# EAGLE design PCB-2x8GPIO-U (EAGLE 6.4)

## Sheet 1 of 2
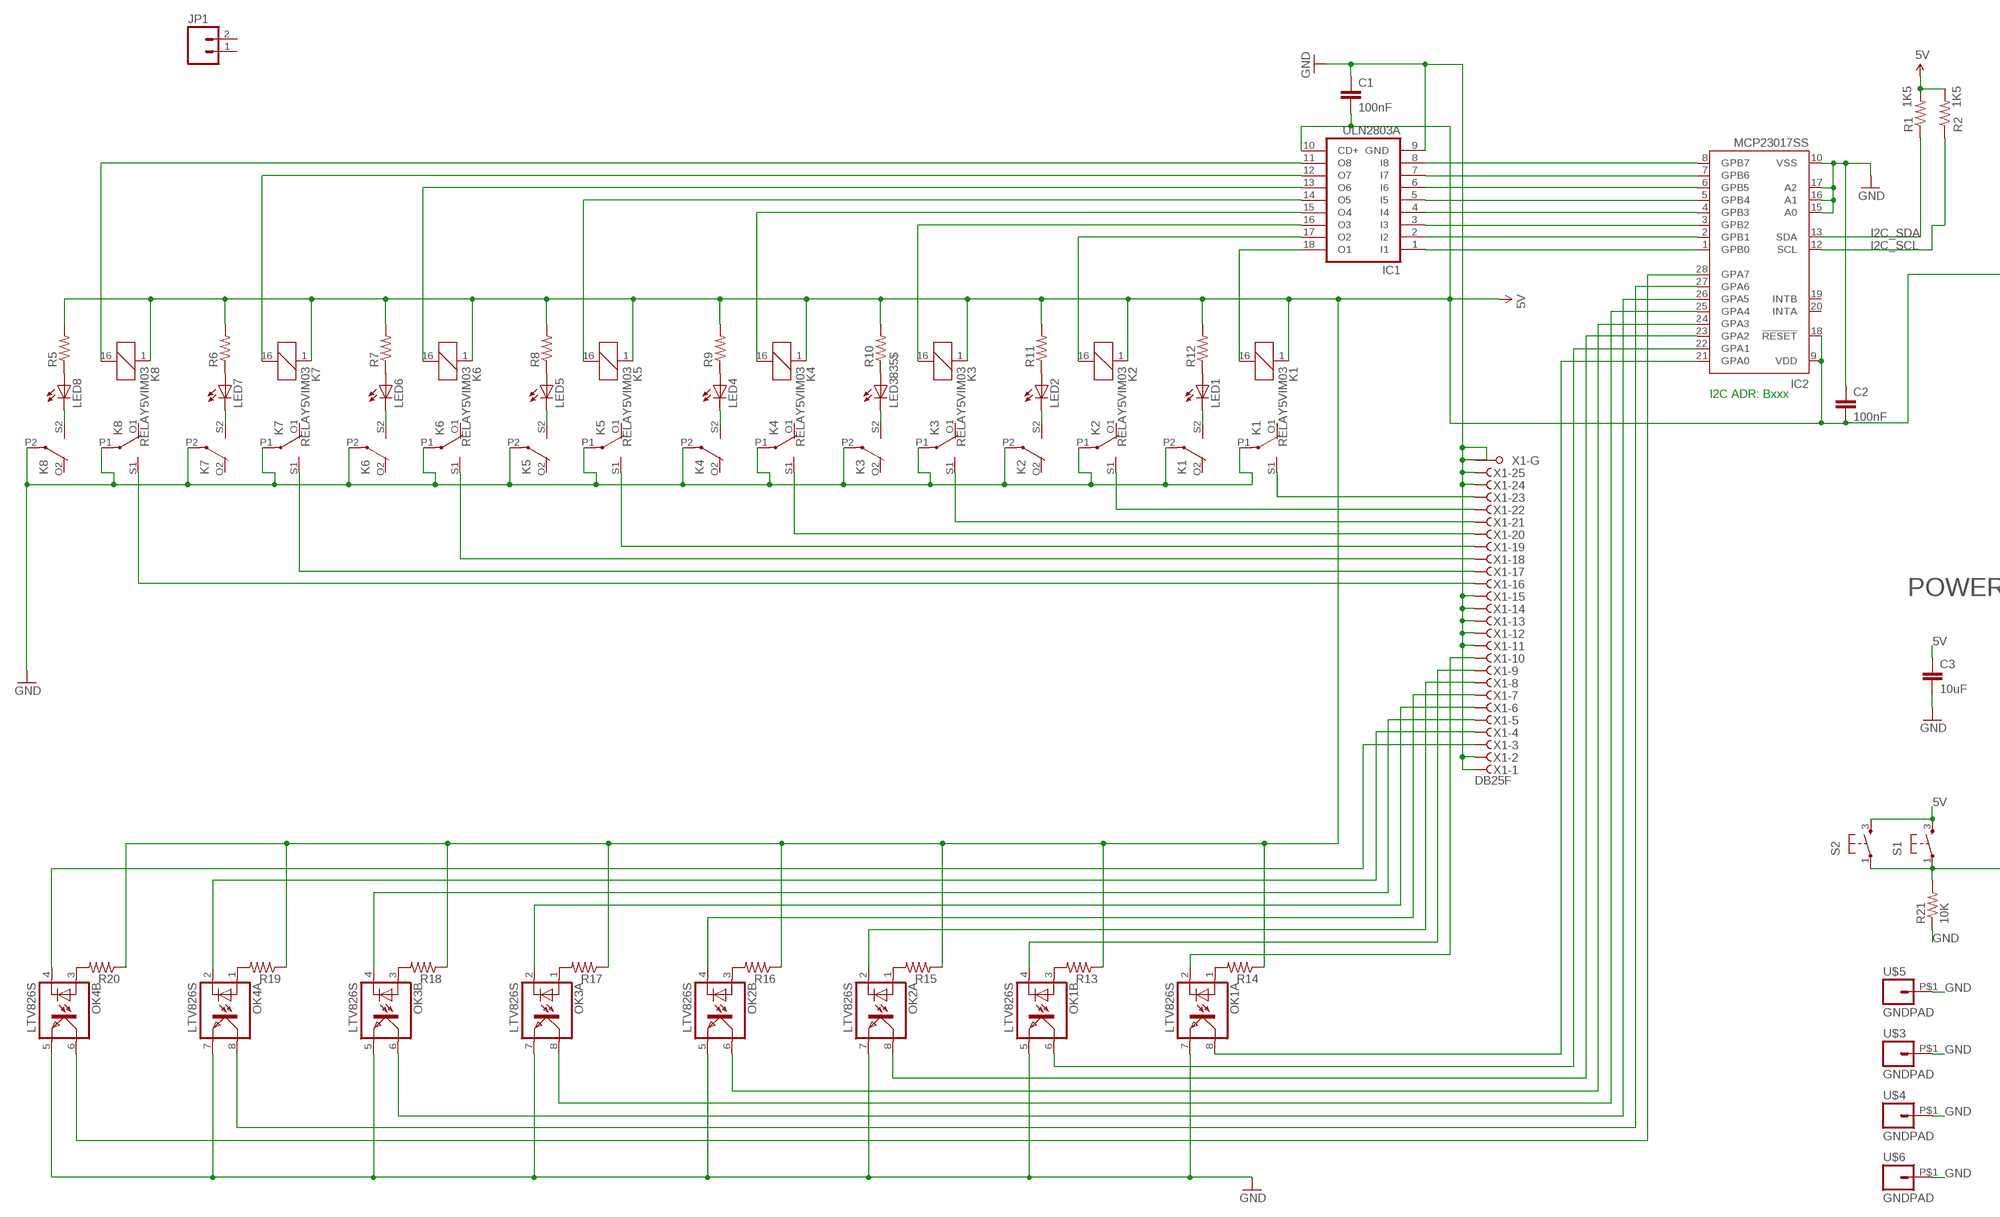
[diagram p0: schematic, sheet 1, part 1 of 2]
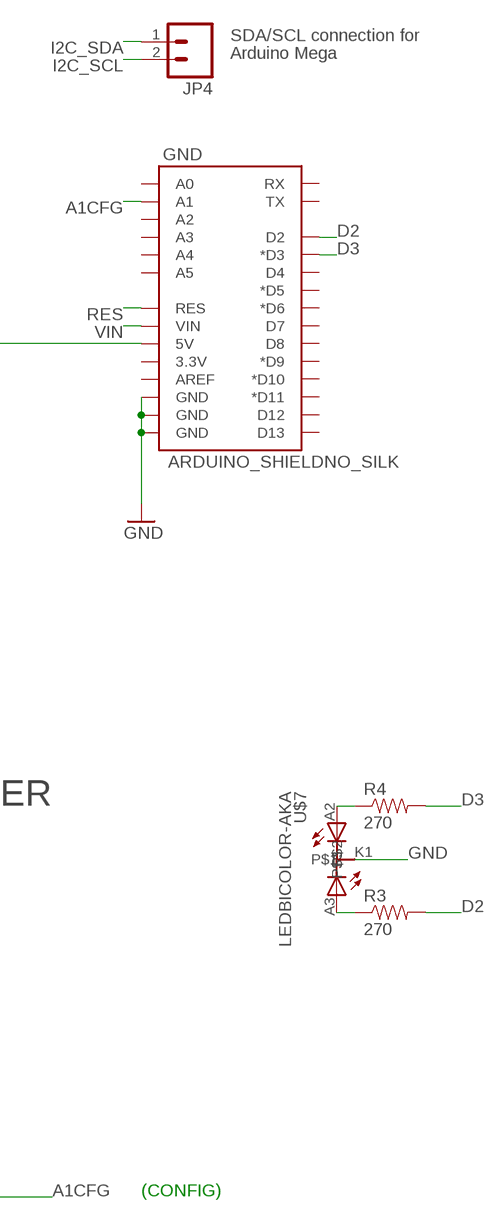
[diagram p1: schematic, sheet 1, part 2 of 2]

### Parts
C1  100nF  CAP0805  [0805]
C2  100nF  CAP0603-CAP  [0603-CAP]
C3  10uF  CAP0805  [0805]
GND  ARDUINO_SHIELDNO_SILK  [DUEMILANOVE_VIAS]
IC1  ULN2803A  ULN2803ASO18W  [SO18W]
IC2  MCP23017SS  [SSOP28]
JP1  M02PTH  [1X02]
JP4  M02PTH  [1X02]
K1  RELAY5VIM03  [DS2Y]
K2  RELAY5VIM03  [DS2Y]
K3  RELAY5VIM03  [DS2Y]
K4  RELAY5VIM03  [DS2Y]
K5  RELAY5VIM03  [DS2Y]
K6  RELAY5VIM03  [DS2Y]
K7  RELAY5VIM03  [DS2Y]
K8  RELAY5VIM03  [DS2Y]
LED1  LED1206  [LED-1206]
LED2  LED1206  [LED-1206]
LED4  LED1206  [LED-1206]
LED5  LED1206  [LED-1206]
LED6  LED1206  [LED-1206]
LED7  LED1206  [LED-1206]
LED8  LED1206  [LED-1206]
LED3835$  LED1206  [LED-1206]
OK1  LTV826S  [DIL8-SMD]
OK2  LTV826S  [DIL8-SMD]
OK3  LTV826S  [DIL8-SMD]
OK4  LTV826S  [DIL8-SMD]
R1  1K5  RESISTOR0603-RES  [0603-RES]
R2  1K5  RESISTOR0603-RES  [0603-RES]
R3  270  RESISTOR0603-RES  [0603-RES]
R4  270  RESISTOR0603-RES  [0603-RES]
R5  RESISTOR0603-RES  [0603-RES]
R6  RESISTOR0603-RES  [0603-RES]
R7  RESISTOR0603-RES  [0603-RES]
R8  RESISTOR0603-RES  [0603-RES]
R9  RESISTOR0603-RES  [0603-RES]
R10  RESISTOR0603-RES  [0603-RES]
R11  RESISTOR0603-RES  [0603-RES]
R12  RESISTOR0603-RES  [0603-RES]
R13  RESISTOR0603-RES  [0603-RES]
R14  RESISTOR0603-RES  [0603-RES]
R15  RESISTOR0603-RES  [0603-RES]
R16  RESISTOR0603-RES  [0603-RES]
R17  RESISTOR0603-RES  [0603-RES]
R18  RESISTOR0603-RES  [0603-RES]
R19  RESISTOR0603-RES  [0603-RES]
R20  RESISTOR0603-RES  [0603-RES]
R21  10K  RESISTOR0603-RES  [0603-RES]
S1  TAC_SWITCH  [PUSHBUTTON]
S2  TAC_SWITCH  [PUSHBUTTON]
U$3  GNDPAD  [3.2MMPAD]
U$4  GNDPAD  [3.2MMPAD]
U$5  GNDPAD  [3.2MMPAD]
U$6  GNDPAD  [3.2MMPAD]
U$7  LEDBICOLOR-AKA  [LED5MM-BICOLOR]
X1  DB25F  F25HPS  [F25HP]

### Nets
5V [PWR]: C1.2 C2.2 C3.1 GND.5V IC1.10(CD+) IC2.9(VDD) IC2.18(!RESET) K1.1 K2.1 K3.1 K4.1 K5.1 K6.1 K7.1 K8.1 R1.2 R2.2 R5.2 R6.2 R7.2 R8.2 R9.2 R10.2 R11.2 R12.2 R13.1 R14.1 R15.1 R16.1 R17.1 R18.1 R19.1 R20.1 S1.3 S2.3
A1CFG: GND.A1 R21.2 S1.1 S2.1
D2: GND.D2 R3.2
D3: GND.D3(*D3) R4.2
GND [PWR]: C1.1 C2.1 C3.2 GND.GND@0(GND) GND.GND@1(GND) GND.GND@2(GND) IC1.9(GND) IC2.10(VSS) IC2.15(A0) IC2.16(A1) IC2.17(A2) K1.P1(2:P) K1.P2(3:P) K2.P1(2:P) K2.P2(3:P) K3.P1(2:P) K3.P2(3:P) K4.P1(2:P) K4.P2(3:P) K5.P1(2:P) K5.P2(3:P) K6.P1(2:P) K6.P2(3:P) K7.P1(2:P) K7.P2(3:P) K8.P1(2:P) K8.P2(3:P) OK1.5(B:EMIT) OK1.7(A:EMIT) OK2.5(B:EMIT) OK2.7(A:EMIT) OK3.5(B:EMIT) OK3.7(A:EMIT) OK4.5(B:EMIT) OK4.7(A:EMIT) R21.1 U$3.P$1 U$4.P$1 U$5.P$1 U$6.P$1 U$7.K1 X1.1(-1:F) X1.2(-2:F) X1.11(-11:F) X1.12(-12:F) X1.13(-13:F) X1.14(-14:F) X1.15(-15:F) X1.24(-24:F) X1.25(-25:F) X1.G1(-G:G1) X1.G2(-G:G2)
I2C_SCL: IC2.12(SCL) JP4.2 R2.1
I2C_SDA: IC2.13(SDA) JP4.1 R1.1
N$1 [RELAY LINES]: K1.S1(2:S) X1.23(-23:F)
N$3: K1.S2(3:S) LED1.C
N$4: IC1.18(O1) K1.16
N$5: IC1.1(I1) IC2.1(GPB0)
N$6 [RELAY LINES]: K2.S1(2:S) X1.22(-22:F)
N$7: R4.1 U$7.A2
N$8: K2.S2(3:S) LED2.C
N$9: IC1.17(O2) K2.16
N$10 [RELAY LINES]: K3.S1(2:S) X1.21(-21:F)
N$11: R3.1 U$7.A3
N$12: K3.S2(3:S) LED3835$.C
N$13: IC1.16(O3) K3.16
N$14 [RELAY LINES]: K4.S1(2:S) X1.20(-20:F)
N$15: LED8.A R5.1
N$16: K4.S2(3:S) LED4.C
N$17: IC1.15(O4) K4.16
N$18 [RELAY LINES]: K5.S1(2:S) X1.19(-19:F)
N$20: K5.S2(3:S) LED5.C
N$21: IC1.14(O5) K5.16
N$22 [RELAY LINES]: K6.S1(2:S) X1.18(-18:F)
N$24: K6.S2(3:S) LED6.C
N$25: IC1.13(O6) K6.16
N$26 [RELAY LINES]: K7.S1(2:S) X1.17(-17:F)
N$27: LED7.A R6.1
N$28: K7.S2(3:S) LED7.C
N$29: IC1.12(O7) K7.16
N$30 [RELAY LINES]: K8.S1(2:S) X1.16(-16:F)
N$32: K8.S2(3:S) LED8.C
N$33: IC1.11(O8) K8.16
N$34: IC1.2(I2) IC2.2(GPB1)
N$35: IC1.3(I3) IC2.3(GPB2)
N$36: IC1.4(I4) IC2.4(GPB3)
N$37: IC1.5(I5) IC2.5(GPB4)
N$38: IC1.6(I6) IC2.6(GPB5)
N$39: IC1.7(I7) IC2.7(GPB6)
N$40: IC1.8(I8) IC2.8(GPB7)
N$41: LED6.A R7.1
N$42: LED5.A R8.1
N$43: LED4.A R9.1
N$44: LED3835$.A R10.1
N$45: LED2.A R11.1
N$46: LED1.A R12.1
N$47: OK1.3(B:A) R13.2
N$48: OK1.1(A:A) R14.2
N$49 [INput lines]: OK1.2(A:C) X1.10(-10:F)
N$50: OK2.1(A:A) R15.2
N$51: IC2.21(GPA0) OK1.8(A:COL)
N$52: OK2.3(B:A) R16.2
N$53: OK3.1(A:A) R17.2
N$54: OK3.3(B:A) R18.2
N$55 [INput lines]: OK3.2(A:C) X1.6(-6:F)
N$56: OK4.1(A:A) R19.2
N$57: OK4.3(B:A) R20.2
N$60 [INput lines]: OK1.4(B:C) X1.9(-9:F)
N$61 [INput lines]: OK2.2(A:C) X1.8(-8:F)
N$62 [INput lines]: OK2.4(B:C) X1.7(-7:F)
N$63: IC2.28(GPA7) OK4.6(B:COL)
N$64 [INput lines]: OK3.4(B:C) X1.5(-5:F)
N$65 [INput lines]: OK4.2(A:C) X1.4(-4:F)
N$66 [INput lines]: OK4.4(B:C) X1.3(-3:F)
N$68: IC2.22(GPA1) OK1.6(B:COL)
N$69: IC2.23(GPA2) OK2.8(A:COL)
N$70: IC2.24(GPA3) OK2.6(B:COL)
N$71: IC2.25(GPA4) OK3.8(A:COL)
N$72: IC2.26(GPA5) OK3.6(B:COL)
N$73: IC2.27(GPA6) OK4.8(A:COL)
RES: GND.RES
VIN: GND.VIN
Unconnected: GND.3.3V GND.A0 GND.A2 GND.A3 GND.A4 GND.A5 GND.AREF GND.D4 GND.D5(*D5) GND.D6(*D6) GND.D7 GND.D8 GND.D9(*D9) GND.D10(*D10) GND.D11(*D11) GND.D12 GND.D13 GND.RX GND.TX IC2.19(INTB) IC2.20(INTA) JP1.1 JP1.2 K1.O1(2:O) K1.O2(3:O) K2.O1(2:O) K2.O2(3:O) K3.O1(2:O) K3.O2(3:O) K4.O1(2:O) K4.O2(3:O) K5.O1(2:O) K5.O2(3:O) K6.O1(2:O) K6.O2(3:O) K7.O1(2:O) K7.O2(3:O) K8.O1(2:O) K8.O2(3:O)

### Notes on the sheet
- SDA/SCL connection for
- Arduino Mega
- I2C ADR: Bxxx
- POWER
- (CONFIG)

## Sheet 2 of 2

## Library data of the parts
C1-C3 = SparkFun:CAP: Capacitor Standard 0603 ceramic capacitor, and 0.1" leaded capacitor.
GND = SparkFun:ARDUINO_SHIELD
IC1 = uln-udn:ULN2803A: DRIVER ARRAY
IC2 = microchip:MCP23017: http://ww1.microchip.com/downloads/en/DeviceDoc/21952a.pdf Source: http://ww1.microchip.com/downloads/en/DeviceDoc/21952a.pdf; MF: MICROCHIP; MPN: MCP23017-E/SS; OC_FARNELL: 1467674; OC_NEWARK: 31K2960
JP1 JP4 = SparkFun:M02: Header 2 Standard 2-pin 0.1" header. Use with straight break away headers (SKU : PRT-00116), right angle break away headers (PRT-00553), swiss pins (PRT-00743), machine pins (PRT-00117), and female headers (PRT-00115). Molex polarized connector foot print use with SKU : PRT-08233 with associated crimp pins and housings.
K1-K8 = SKAARHOJ:RELAY5V: RELAY 2 x switch, AxiCom 150 mW 5V
LED1 LED2 LED4-LED8 LED3835$ = SparkFun:LED: LEDs Standard schematic elements and footprints for 5mm, 3mm, 1206, and 0603 sized LEDs. 5mm - Spark Fun Electronics SKU : COM-00529 (and others)
OK1-OK4 = optocoupler:LTV826: OPTO COUPLER Source: LITEON, LTV816.pdf; OC_FARNELL: unknown; OC_NEWARK: unknown
R1-R21 = SparkFun:RESISTOR: Resistor Basic schematic elements and footprints for 0603, 1206, and PTH resistors.
S1 S2 = SKAARHOJ:TAC_SWITCH: Momentary Switch Button commonly used for reset or general input. Spark Fun Electronics SKU : COM-00097
U$3-U$6 = SKAARHOJ:GNDPAD
U$7 = SKAARHOJ:LEDBICOLOR-AKA
X1 = con-subd:F25HPS: SUB-D; OC_FARNELL: unknown; OC_NEWARK: unknown

## Net classes
0 default: width 0.203 mm, drill 0.406 mm, clearance 0.203 mm
1 PWR: width 0.406 mm, drill 0.61 mm, clearance 0.203 mm
2 RELAY LINES: width 0.305 mm, clearance 0.203 mm
3 INput lines: clearance 0.203 mm

## Board
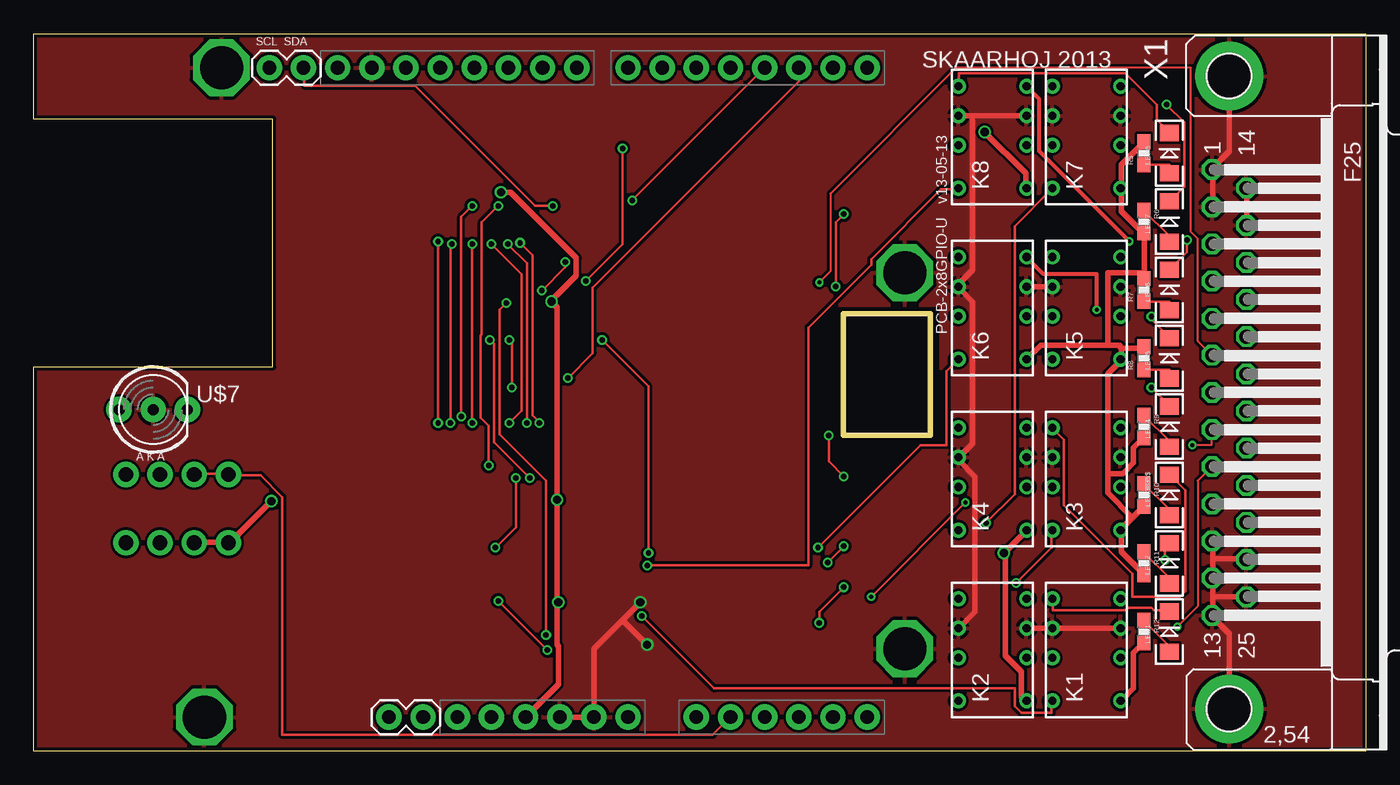
[diagram p2: board, top side]
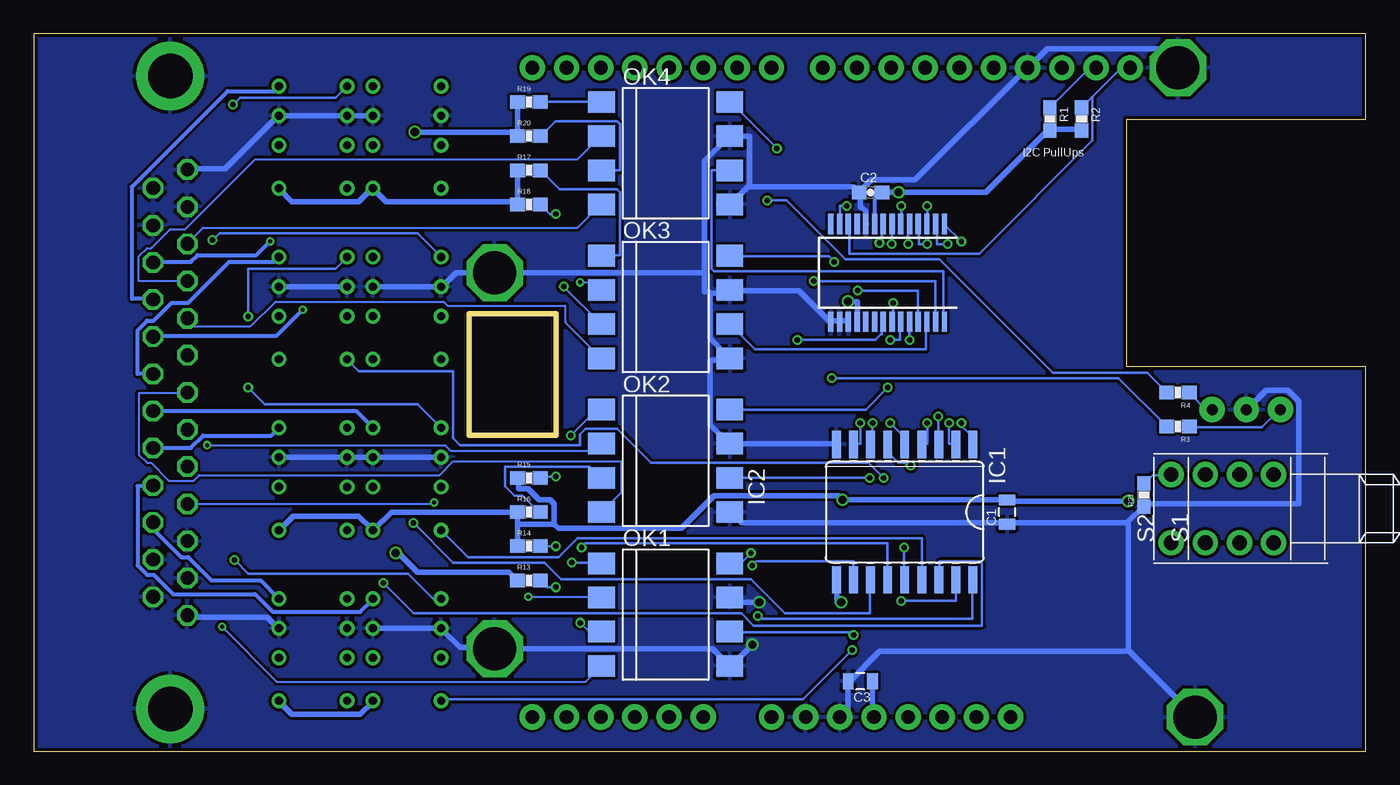
[diagram p3: board, bottom side, seen from below]

Size 99.06 x 53.34 mm. Coordinates in mm from the lower left corner, seen from the top.
Outline: 0,0 0,28.57 17.78,28.57 17.78,46.99 0,46.99 0,53.34 99.06,53.34 99.06,0 0,0
Copper layers (1*16): Top 0.035mm / dielectric 1.5mm / Bottom 0.035mm
Design rules "Fusion_eagle_rule_v1.1": minimum track width 6mil, minimum drill 12mil, track to track 6mil, track to pad 6mil, pad to pad 6mil, via to via 6mil, smd to smd 0mil, copper to edge 10mil, drill to drill 10mil, minimum pad ring 10mil, minimum via ring 6mil, stop-mask expansion 2mil, vias tented up to drill 100mil, thermal gap 10mil
tRestrict: area 59.7,22.9 to 67.3,33
bRestrict: area 59.7,22.9 to 67.3,33
Milling: 4 lines

### Footprints (pad centres in the part's own frame; a part is rotated, then mirrored left to right if it is on the bottom)
0805 = smd 0.8 x 1.2: 1 -0.9,0; 2 0.9,0
0603-CAP = smd 1.1 x 1: 1 -0.85,0; 2 0.85,0
DUEMILANOVE_VIAS = drill 1.016 pad 1.88: 3.3V 50.8,13.97; 5V 50.8,16.51; A0 50.8,29.21; A1 50.8,31.75; A2 50.8,34.29; A3 50.8,36.83; A4 50.8,39.37; A5 50.8,41.91; AREF 2.54,2.54; D2 2.54,36.83; D3 2.54,34.29; D4 2.54,31.75; D5 2.54,29.21; D6 2.54,26.67; D7 2.54,24.13; D8 2.54,20.32; D9 2.54,17.78; D10 2.54,15.24; D11 2.54,12.7; D12 2.54,10.16; D13 2.54,7.62; GND@0 50.8,19.05; GND@1 50.8,21.59; GND@2 2.54,5.08; RES 50.8,11.43; RX 2.54,41.91; TX 2.54,39.37; VIN 50.8,24.13
SO18W = smd 0.66 x 2.032: 1 -5.08,-5.029; 2 -3.81,-5.029; 3 -2.54,-5.029; 4 -1.27,-5.029; 5 0,-5.029; 6 1.27,-5.029; 7 2.54,-5.029; 8 3.81,-5.029; 9 5.08,-5.029; 10 5.08,5.029; 11 3.81,5.029; 12 2.54,5.029; 13 1.27,5.029; 14 0,5.029; 15 -1.27,5.029; 16 -2.54,5.029; 17 -3.81,5.029; 18 -5.08,5.029
SSOP28 = smd 0.4 x 1.5: 1 -4.225,-3.625; 2 -3.575,-3.625; 3 -2.925,-3.625; 4 -2.275,-3.625; 5 -1.625,-3.625; 6 -0.975,-3.625; 7 -0.325,-3.625; 8 0.325,-3.625; 9 0.975,-3.625; 10 1.625,-3.625; 11 2.275,-3.625; 12 2.925,-3.625; 13 3.575,-3.625; 14 4.225,-3.625; 15 4.225,3.625; 16 3.575,3.625; 17 2.925,3.625; 18 2.275,3.625; 19 1.625,3.625; 20 0.975,3.625; 21 0.325,3.625; 22 -0.325,3.625; 23 -0.975,3.625; 24 -1.625,3.625; 25 -2.275,3.625; 26 -2.925,3.625; 27 -3.575,3.625; 28 -4.225,3.625
1X02 = drill 1.016 pad 1.88: 1 0,0; 2 2.54,0
DS2Y = drill 0.6: 1 1.2,0.46; 16 1.2,5.54; O1 4.4,0.46; O2 4.4,5.54; P1 6.6,0.46; P2 6.6,5.54; S1 8.8,0.46; S2 8.8,5.54
LED-1206 = smd 1.2 x 1.4: A -1.5,0; C 1.5,0
DIL8-SMD = smd 1.6 x 2: 1 -3.81,-4.77; 2 -1.27,-4.77; 3 1.27,-4.77; 4 3.81,-4.77; 5 3.81,4.77; 6 1.27,4.77; 7 -1.27,4.77; 8 -3.81,4.77
0603-RES = smd 1.1 x 1: 1 -0.85,0; 2 0.85,0
PUSHBUTTON = drill 1.1 pad 1.88: 1 2.54,2.54; 2 2.54,-2.54; 3 -2.54,2.54; 4 -2.54,-2.54
3.2MMPAD = drill 3.2 octagon: P$1 0,0
LED5MM-BICOLOR = drill 0.813 pad 1.88: A2 2.54,0; A3 -2.54,0; K1 0,0
F25HP = drill 1.016 octagon: 1 -16.561,-1.27; 2 -13.792,-1.27; 3 -11.049,-1.27; 4 -8.28,-1.27; 5 -5.512,-1.27; 6 -2.769,-1.27; 7 0,-1.27; 8 2.769,-1.27; 9 5.512,-1.27; 10 8.28,-1.27; 11 11.049,-1.27; 12 13.792,-1.27; 13 16.561,-1.27; 14 -15.189,1.27; 15 -12.421,1.27; 16 -9.652,1.27; 17 -6.909,1.27; 18 -4.14,1.27; 19 -1.372,1.27; 20 1.372,1.27; 21 4.14,1.27; 22 6.909,1.27; 23 9.652,1.27; 24 12.421,1.27; 25 15.189,1.27 | drill 3.302 pad 5.08: G1 -23.52,0; G2 23.52,0

### Placement (x,y rotation side)
C1  26.67,17.78 90 bottom
C2  36.83,41.53 0 bottom
C3  37.59,5.21 180 bottom
GND  20.07,53.34 270 top
IC1  34.29,17.78 180 bottom
IC2  35.56,35.56 180 bottom
JP1  26.42,2.54 0 top
JP4  20.07,50.8 180 top
K1  81.28,2.54 90 top
K2  74.3,2.54 90 top
K3  81.28,15.24 90 top
K4  74.3,15.24 90 top
K5  81.28,27.94 90 top
K6  74.3,27.94 90 top
K7  81.28,40.64 90 top
K8  74.3,40.64 90 top
LED1  84.45,8.89 90 top
LED2  84.45,13.97 90 top
LED4  84.45,24.13 90 top
LED5  84.45,29.21 90 top
LED6  84.45,34.29 90 top
LED7  84.45,39.37 90 top
LED8  84.45,44.45 90 top
LED3835$  84.45,19.05 90 top
OK1  52.07,10.16 270 bottom
OK2  52.07,21.59 270 bottom
OK3  52.07,33.02 270 bottom
OK4  52.07,44.45 270 bottom
R1  23.5,46.99 270 bottom
R2  21.13,46.99 270 bottom
R3  13.97,24.13 180 bottom
R4  13.97,26.67 180 bottom
R5  82.55,44.45 90 top
R6  82.55,39.37 270 top
R7  82.55,34.29 90 top
R8  82.55,29.21 90 top
R9  82.55,24.13 270 top
R10  82.55,19.05 270 top
R11  82.55,13.97 270 top
R12  82.55,8.89 270 top
R13  62.23,12.7 0 bottom
R14  62.23,15.24 0 bottom
R15  62.23,20.32 0 bottom
R16  62.23,17.78 0 bottom
R17  62.23,43.18 0 bottom
R18  62.23,40.64 0 bottom
R19  62.23,48.26 0 bottom
R20  62.23,45.72 0 bottom
R21  16.51,19.05 90 bottom
S1  9.4,18.03 90 bottom
S2  11.94,18.03 90 bottom
U$3  64.77,7.62 0 top
U$4  64.77,35.56 0 top
U$5  13.97,50.8 0 top
U$6  12.7,2.54 0 top
U$7  8.89,25.4 0 top
X1  88.9,26.67 270 top

### Tracks (layer width: path | path; a pad name or v marks a point on that pad's centre or on a via)
5V  (via drill 0.61)
  Top 0.406: R12.2 82.5,8.03 81.79,7.32 81.79,4.67 80.87,3.76 K1.1 | K4.1 73.76,16.36 v72.14,14.73 72.24,14.63 72.24,7.11 73.46,5.89 73.46,4.06 73.76,3.76 K2.1 | v70.71,46.02 73.76,42.98 73.76,41.86 K8.1 | R5.2 82.5,45.21 80.87,43.59 80.87,41.86 K7.1 80.87,41.66 80.87,40.13 82.4,38.61 R6.2 82.6,38.51 82.6,35.15 R7.2 82.5,35.56 79.86,35.56 79.86,30.18 | 80.87,29.97 82.5,29.97 R8.2 | 80.87,29.97 80.87,29.16 K5.1 80.77,28.96 79.86,28.04 79.86,20.62 | 79.86,30.18 80.77,30.18 80.77,30.07 80.87,29.97 | 79.86,30.18 74.88,30.18 73.86,29.16 K6.1 | R11.2 82.5,13.21 80.87,14.83 80.87,16.36 K3.1 80.97,16.56 80.97,16.66 81.69,17.37 | 81.69,17.37 82.5,18.19 R10.2 | 79.86,20.62 80.97,20.62 81.79,21.44 81.79,22.55 82.5,23.27 R9.2 | 79.86,20.62 79.86,19.2 81.69,17.37 | v17.68,18.59 14.53,15.44 S2.3 14.33,15.54 11.99,15.54 S1.3 | 38.91,11.07 38.91,7.92 39.01,7.82 39.01,4.98 GND.5V | 38.91,11.07 v38.91,18.69 38.91,33.02 v38.51,33.43 38.61,33.53 38.61,33.63 40.34,35.36 40.34,36.68 35.46,41.55 v34.75,41.55 | v39.01,11.07 38.91,11.07
  Bottom 0.305: C2.2 36.53,41.53 IC2.9
  Bottom 0.406: K2.1 73.86,3.66 74.78,2.74 79.86,2.74 80.77,3.66 K1.1 | 63.09,16.87 63.09,17.78 R16.1 72.44,17.78 73.76,16.46 K4.1 73.97,16.56 74.88,17.48 79.76,17.48 80.77,16.46 K3.1 | 63.09,16.87 63.09,15.24 R14.1 | 60.35,16.87 60.35,18.39 60.66,18.69 61.47,18.69 62.28,19.51 62.99,19.51 62.99,20.32 R15.1 | 63.09,16.87 60.35,16.87 | v72.14,14.73 71.93,14.73 70.51,13.31 63.7,13.31 63.09,12.7 R13.1 | R19.1 63.09,48.26 63.09,45.72 R20.1 63.2,46.02 v70.71,46.02 | R17.1 63.09,43.18 63.09,40.64 R18.1 63.2,40.84 72.85,40.84 73.76,41.76 K8.1 73.97,41.76 74.88,40.84 79.86,40.84 80.77,41.76 K7.1 | v17.68,18.59 26.62,18.59 C1.2 26.82,18.69 v38.91,18.69 39.22,19 48.46,19 50.9,16.56 60.05,16.56 60.35,16.87 | R2.2 21.13,46.23 23.47,46.23 R1.2 23.67,46.13 28.25,41.55 v34.75,41.55 35.87,41.55 C2.2 | GND.5V 36.68,2.54 36.68,5.18 C3.1 | v38.51,33.43 37.8,33.43 37.8,32 IC2.18 | v39.01,11.07 39.32,11.07 39.32,12.7 IC1.10
A1CFG
  Top 0.203: GND.A1 50.49,1.22 18.49,1.22 18.49,18.9 16.87,20.52 14.53,20.52 S2.1 14.43,20.62 11.99,20.62 S1.1
  Bottom 0.203: R21.2 16.46,19.91 15.85,20.52 14.53,20.52 S2.1
D2  (via drill 0.41)
  Top 0.203: v39.73,27.74 41.55,29.57 41.55,34.44 56.9,49.78 GND.D2
  Bottom 0.203: v39.73,27.74 18.39,27.74 14.83,24.18 R3.2
D3  (via drill 0.41)
  Top 0.203: GND.D3 v44.5,40.95
  Bottom 0.203: v44.5,40.95 43.08,40.95 38.71,36.58 31.7,36.58 23.27,28.14 16.26,28.14 14.83,26.72 R4.2
GND  (via drill 0.61)
  Top 0.406: 43.79,9.75 41.66,7.62 GND.GND@1 GND.GND@0 | 43.79,9.75 v45.11,11.07 | 87.68,11.48 87.68,12.8 X1.12 87.68,13.01 87.68,14.33 | 87.68,11.48 87.68,10.16 X1.13 87.68,9.96 88.9,8.74 X1.G2 | 87.68,14.33 87.68,15.54 X1.11 | 87.68,11.48 X1.25 | 87.68,14.33 90.12,14.33 X1.24 | K2.P1 73.86,9.14 75.69,9.14 K1.P2 75.89,9.14 80.77,9.14 K1.P1 | K6.P1 73.86,34.54 75.69,34.54 K5.P2 | 69.8,47.24 73.76,47.24 K8.P1 | 69.8,47.24 68.78,47.24 K8.P2 | 90.22,40.54 90.22,41.86 X1.14 | 90.22,40.54 90.22,39.12 X1.15 | 90.22,40.54 87.68,40.54 X1.2 87.68,40.74 87.68,43.18 X1.1 87.68,43.38 88.9,44.6 X1.G1 | 69.8,47.24 69.8,35.76 68.78,34.75 K6.P2 68.78,34.44 69.8,33.43 69.8,22.86 68.78,21.84 K4.P2 68.78,21.64 70,20.42 70,10.36 68.78,9.14 K2.P2 | v45.62,7.92 43.79,9.75
  Bottom 0.406: U$5.P$1 14.02,50.8 15.44,52.22 23.67,52.22 25.09,50.8 GND.GND@2 25.3,50.7 33.53,42.47 36.78,42.47 37.59,41.66 C2.1 | C2.1 37.59,41.45 37.59,40.44 37.49,40.44 37.19,40.13 37.19,39.22 IC2.10 | 45.82,42.06 47.24,40.64 OK4.5 | 45.82,42.06 45.82,45.72 OK4.7 47.45,45.62 49.17,43.89 49.17,35.56 | C2.1 37.8,41.66 38.1,41.96 45.72,41.96 45.82,42.06 | IC1.9 39.42,22.86 OK2.7 47.45,22.96 48.77,24.28 48.77,29.06 47.35,29.06 OK3.5 47.35,29.26 48.77,30.68 48.77,34.04 | IC2.17 38.51,32 39.12,32 IC2.16 39.32,32 39.73,32 IC2.15 39.93,32 42.16,34.24 47.24,34.24 OK3.7 47.24,34.04 48.77,34.04 | 49.17,35.56 49.17,34.14 48.87,34.14 48.77,34.04 | GND.GND@0 38.51,2.54 38.51,5.18 C3.2 38.3,5.28 36.17,7.42 17.78,7.42 17.68,7.52 | v45.11,11.07 46.94,11.07 47.24,11.38 OK1.7 | 17.78,16.97 16.56,18.19 R21.1 16.46,18.39 4.98,18.39 4.98,26.01 5.79,26.82 7.42,26.82 8.84,25.4 U$7.K1 | 17.78,16.97 26.62,16.97 C1.1 26.82,16.97 46.43,16.97 47.24,17.78 OK2.5 | 17.68,7.52 U$6.P$1 | 17.68,7.52 17.68,16.87 17.78,16.97 | K2.P1 73.76,9.14 68.89,9.14 K2.P2 68.68,9.04 67.36,7.72 64.92,7.72 U$3.P$1 48.56,7.62 47.35,6.4 OK1.5 47.14,6.4 v45.62,7.92 | X1.13 87.48,9.96 81.69,9.96 80.87,9.14 K1.P1 | K4.P2 68.78,21.84 73.76,21.84 K4.P1 73.97,21.84 75.69,21.84 K3.P2 75.89,21.84 80.77,21.84 K3.P1 | K5.P1 80.77,34.54 75.79,34.54 K5.P2 | K6.P1 73.76,34.54 68.89,34.54 K6.P2 68.68,34.54 67.67,35.56 U$4.P$1 49.17,35.56 | K8.P1 73.86,47.24 75.69,47.24 K7.P2 75.89,47.24 80.77,47.24 K7.P1 80.97,47.14 84.84,43.28 87.58,43.28 X1.1
  pour Top: 0,0 99.06,0 99.06,53.34 0,53.34
  pour Bottom: 0,0 99.06,0 99.06,53.34 0,53.34
I2C_SCL
  Bottom 0.203: 20.37,48.62 18.19,50.8 JP4.2 | 20.37,48.62 21.13,47.85 R2.1 | IC2.12 38.41,39.12 38.41,36.98 28.75,36.98 20.32,45.41 20.32,48.56 20.37,48.62
I2C_SDA  (via drill 0.41)
  Top 0.203: v38.61,40.54 37.29,40.54 28.35,49.48 20.12,49.48 20.12,50.8 JP4.1
  Bottom 0.203: JP4.1 20.52,50.8 23.47,47.85 R1.1 | v38.61,40.54 39.12,40.54 39.12,39.22 IC2.13
N$1
  Bottom 0.305: K1.S1 80.87,11.38 82.19,12.7 85.85,12.7 87.58,14.43 88.09,14.43 90.12,16.46 90.12,16.97 X1.23
N$3
  Top 0.203: LED1.C 84.43,10.46 83.31,10.46 83.11,10.67 81.38,10.67 81.18,10.46 75.79,10.46 75.79,11.28 K1.S2
N$4  (via drill 0.41)
  Top 0.203: v45.21,10.06 50.6,4.67 72.95,4.67 72.95,3.35 73.46,2.85 75.69,2.85 75.69,3.66 K1.16
  Bottom 0.203: v45.21,10.06 45.01,9.86 29.26,9.86 29.26,12.7 IC1.18
N$5  (via drill 0.41)
  Top 0.203: v30.07,24.38 v30.07,37.9
  Bottom 0.203: v30.07,37.9 31.29,39.12 IC2.1 | v30.07,24.38 30.07,24.18 29.26,23.37 29.26,22.86 IC1.1
N$6
  Bottom 0.305: K2.S1 73.86,11.28 74.78,10.36 81.28,10.36 82.6,11.68 88.7,11.68 90.12,13.11 90.63,13.11 91.34,13.82 91.34,19.71 90.22,19.71 X1.22
N$7
  Bottom 0.203: U$7.A2 11.89,25.4 13.11,26.62 R4.1
N$8  (via drill 0.41)
  Top 0.203: v84.12,14.22 84.12,15.14 84.43,15.44 LED2.C
  Bottom 0.203: v84.12,14.22 83.11,13.21 71.22,13.21 69.39,11.38 68.78,11.38 K2.S2
N$9  (via drill 0.41)
  Top 0.203: v38.2,7.52 v34.54,11.18
  Bottom 0.203: IC1.17 30.48,11.18 v34.54,11.18 | v38.2,7.52 41.86,3.86 68.58,3.86 68.68,3.76 K2.16
N$10
  Bottom 0.305: K3.S1 80.87,23.98 81.38,23.47 86.46,23.47 87.38,22.55 90.12,22.55 X1.21
N$11
  Bottom 0.203: R3.1 13.11,24.08 7.72,24.08 6.4,25.4 U$7.A3
N$12
  Top 0.203: LED3835$.C 84.53,20.52 85.65,19.41 85.65,11.89 85.24,11.48 81.69,11.48 81.69,13.21 76.61,18.29 76.61,23.16 75.79,23.98 K3.S2
N$13  (via drill 0.41)
  Top 0.203: v73.05,12.5 75.69,15.14 75.69,16.36 K3.16
  Bottom 0.203: v73.05,12.5 70.81,10.26 46.43,10.26 45.52,9.35 28.55,9.35 28.55,13.92 28.75,14.12 31.7,14.12 31.7,12.8 IC1.16
N$14
  Bottom 0.305: X1.20 75.08,25.3 73.86,24.08 K4.S1
N$15
  Top 0.203: R5.1 82.6,43.59 84.43,43.59 84.43,42.98 LED8.A
N$16  (via drill 0.41)
  Top 0.203: v83.11,27.03 84.43,25.7 LED4.C
  Bottom 0.203: v83.11,27.03 81.89,25.81 70.51,25.81 68.78,24.08 K4.S2
N$17
  Bottom 0.203: IC1.15 33.02,15.85 58.62,15.85 60.05,14.43 66.75,14.43 68.68,16.36 K4.16
N$18
  Bottom 0.305: X1.19 91.34,28.04 91.34,31.29 90.63,32 90.12,32 88.8,33.33 87.58,33.33 84.53,36.37 81.18,36.37 80.87,36.68 K5.S1
N$20  (via drill 0.41)
  Top 0.203: v83.11,32.31 83.11,32.11 84.43,30.79 LED5.C
  Bottom 0.203: v83.11,32.31 83.11,35.87 76.61,35.87 75.79,36.68 K5.S2
N$21  (via drill 0.41)
  Top 0.203: v34.34,15.14 35.87,16.66 v35.87,20.32
  Bottom 0.203: v34.34,15.14 34.34,12.8 IC1.14 | v35.87,20.32 36.98,21.44 53.14,21.44 55.68,23.98 58.01,23.98 58.42,23.57 58.42,22.76 67.36,22.76 67.87,23.27 67.87,28.25 74.88,28.25 75.69,29.06 K5.16
N$22  (via drill 0.3)
  Top 0.305: v79.05,32.82 79.05,35.46 75.08,35.46 73.86,36.68 K6.S1
  Bottom 0.305: v79.05,32.82 80.97,30.89 90.12,30.89 X1.18
N$24  (via drill 0.41)
  Top 0.203: v85.75,38 85.75,37.08 84.53,35.87 LED6.C
  Bottom 0.203: v85.75,38 85.24,38.51 70.51,38.51 68.78,36.78 K6.S2
N$25  (via drill 0.41)
  Top 0.203: v58.32,15.14 65.94,22.76 67.87,22.76 67.87,28.25 68.68,29.06 K6.16
  Bottom 0.203: IC1.13 35.56,15.44 58.01,15.44 v58.32,15.14
N$26
  Bottom 0.305: K7.S1 80.87,49.38 81.18,49.07 84.63,49.07 91.75,41.96 91.75,33.63 90.22,33.63 X1.17
N$27
  Top 0.203: R6.1 82.6,40.13 84.43,38.3 84.43,37.9 LED7.A
N$28  (via drill 0.41)
  Top 0.203: v84.23,48.06 85.55,46.74 85.55,41.96 84.53,40.95 LED7.C
  Bottom 0.203: v84.23,48.06 83.72,48.56 76.61,48.56 75.79,49.38 K7.S2
N$29  (via drill 0.41)
  Top 0.203: v70.81,16.97 72.95,19.1 72.95,39.01 75.69,41.76 K7.16
  Bottom 0.203: v70.81,16.97 67.87,14.02 61.06,14.02 59.84,12.8 45.72,12.8 43.18,10.26 36.88,10.26 36.88,12.7 IC1.12
N$30  (via drill 0.3)
  Top 0.305: v81.48,37.9 74.78,44.6 74.78,48.46 73.86,49.38 K8.S1
  Bottom 0.305: v81.48,37.9 82.5,36.88 86.87,36.88 87.38,36.37 90.12,36.37 X1.16
N$32
  Top 0.203: LED8.C 84.43,46.02 83.52,46.94 83.52,48.06 81.18,50.39 68.78,50.39 68.78,49.48 K8.S2
N$33  (via drill 0.41)
  Top 0.203: v45.62,13.82 57.61,13.82 57.61,31.5 62.28,36.17 62.28,36.58 67.46,41.76 68.68,41.76 K8.16
  Bottom 0.203: IC1.11 38.1,14.12 45.31,14.12 v45.62,13.82
N$34  (via drill 0.41)
  Top 0.203: v31.09,37.69 30.99,37.59 v30.99,24.38
  Bottom 0.203: v31.09,37.69 31.9,37.69 31.9,39.12 IC2.2 | v30.99,24.38 30.99,22.86 30.48,22.86 IC1.2
N$35  (via drill 0.41)
  Top 0.203: v32.61,40.54 31.8,39.73 v31.8,24.89
  Bottom 0.203: v32.61,40.54 32.61,39.22 IC2.3 | v31.8,24.89 31.8,22.86 IC1.3
N$36  (via drill 0.41)
  Top 0.203: v32.61,24.38 v32.61,37.69
  Bottom 0.203: v32.61,37.69 33.22,37.69 33.22,39.12 IC2.4 | v32.61,24.38 32.61,22.86 33.02,22.86 IC1.4
N$37  (via drill 0.41)
  Top 0.203: v34.04,37.69 36.27,35.46 36.27,25.3 v35.36,24.38
  Bottom 0.203: v34.04,37.69 34.04,39.12 IC2.5 | v35.36,24.38 34.34,23.37 34.34,22.86 IC1.5
N$38  (via drill 0.41)
  Top 0.203: v34.54,40.54 33.33,39.32 33.33,30.99 33.22,30.89 33.22,24.79 33.83,24.18 v33.83,21.23
  Bottom 0.203: v34.54,40.54 34.54,39.22 IC2.6 | v33.83,21.23 34.04,21.44 34.75,21.44 35.56,22.25 IC1.6
N$39  (via drill 0.41)
  Top 0.203: v35.26,37.69 36.68,36.27 v36.68,24.38
  Bottom 0.203: v35.26,37.69 35.26,39.12 IC2.7 | v36.68,24.38 36.68,22.86 36.78,22.86 IC1.7
N$40  (via drill 0.41)
  Top 0.203: v36.17,37.8 37.08,36.88 37.08,24.99 37.59,24.49 v37.59,24.38
  Bottom 0.203: v36.17,37.8 35.97,37.8 35.97,39.12 IC2.8 | v37.59,24.38 37.59,22.86 38.1,22.86 IC1.8
N$41
  Top 0.203: R7.1 82.6,33.43 84.43,33.43 84.43,32.82 LED6.A
N$42
  Top 0.203: R8.1 82.6,28.35 84.43,28.35 84.43,27.74 LED5.A
N$43
  Top 0.203: R9.1 82.6,24.89 84.43,23.06 84.43,22.66 LED4.A
N$44
  Top 0.203: R10.1 82.6,19.81 84.43,17.98 84.43,17.58 LED3835$.A
N$45
  Top 0.203: R11.1 82.6,14.73 84.43,12.9 84.43,12.5 LED2.A
N$46
  Top 0.203: R12.1 82.6,9.65 84.43,7.82 84.43,7.42 LED1.A
N$47  (via drill 0.41)
  Top 0.203: v60.25,12.19 58.42,10.36 v58.42,9.55
  Bottom 0.203: v60.25,12.19 60.86,12.19 61.37,12.7 R13.2 | v58.42,9.55 57.81,8.94 56.9,8.94 OK1.3
N$48  (via drill 0.41)
  Top 0.203: v59.03,14.02 v60.25,15.24
  Bottom 0.203: v60.25,15.24 R14.2 | v59.03,14.02 56.9,14.02 OK1.1
N$49  (via drill 0.3)
  Top 0.152: v69.29,18.49 v62.28,11.48
  Bottom 0.152: v62.28,11.48 56.9,11.48 OK1.2 | v69.29,18.49 69.39,18.39 X1.10
N$50  (via drill 0.41)
  Top 0.203: v60.25,20.42 59.13,21.54 v59.13,23.47
  Bottom 0.203: v60.25,20.42 61.27,20.42 61.37,20.32 R15.2 | v59.13,23.47 57.2,25.4 OK2.1
N$51  (via drill 0.41)
  Top 0.203: v42.27,30.58 45.72,27.13 v45.72,14.73
  Bottom 0.203: v42.27,30.58 36.47,30.58 36.07,30.99 35.97,30.99 35.97,31.9 IC2.21 | v45.72,14.73 46.43,14.02 47.24,14.02 OK1.8
N$52
  Bottom 0.203: R16.2 61.47,17.78 62.69,19 63.3,19 64.01,19.71 64.01,21.13 57.71,21.13 56.9,20.32 OK2.3
N$53
  Bottom 0.203: R17.2 61.37,43.18 59.94,41.76 55.68,41.76 55.47,41.55 55.47,36.88 56.79,36.88 OK3.1
N$54  (via drill 0.41)
  Top 0.203: v60.25,39.93 59.64,39.32 v59.64,34.54
  Bottom 0.203: v60.25,39.93 60.66,39.93 61.37,40.64 R18.2 | v59.64,34.54 56.9,31.8 OK3.3
N$55  (via drill 0.3)
  Top 0.152: v58.42,34.85 59.23,35.66 59.23,41.45 68.58,50.8 86.06,50.8 86.06,38.61 86.56,38.1 86.56,30.48 87.58,29.46 X1.6
  Bottom 0.152: v58.42,34.85 57.4,34.85 56.9,34.34 OK3.2
N$56
  Bottom 0.203: OK4.1 R19.2
N$57
  Bottom 0.203: OK4.3 55.47,43.18 55.47,46.63 55.68,46.84 60.25,46.84 61.37,45.72 R20.2
N$60  (via drill 0.3)
  Top 0.152: v85.04,9.25 86.56,10.77 86.56,20.12 87.58,21.13 X1.9
  Bottom 0.152: v85.04,9.25 80.97,5.18 58.01,5.18 56.9,6.3 OK1.4
N$61  (via drill 0.3)
  Top 0.152: v86.16,22.76 87.58,22.76 87.58,23.88 X1.8
  Bottom 0.152: v86.16,22.76 68.48,22.76 68.07,22.35 57.4,22.35 56.9,22.86 OK2.2
N$62
  Bottom 0.152: OK2.4 56.79,17.78 55.37,19.2 55.37,21.54 67.87,21.54 68.89,20.52 86.77,20.52 87.17,20.12 89,20.12 90.32,21.44 90.63,21.44 91.24,22.05 91.24,26.62 87.68,26.62 X1.7
N$63
  Bottom 0.203: OK4.6 48.67,43.18 48.67,35.87 48.46,35.66 31.39,35.66 31.39,32 IC2.28
N$64
  Bottom 0.152: OK3.4 56.9,29.26 59.54,31.9 59.54,33.12 68.28,33.12 68.58,33.43 81.08,33.43 82.91,31.6 87.07,31.6 87.58,32.11 X1.5
N$65
  Bottom 0.152: X1.4 91.24,34.95 91.24,36.78 90.63,37.39 90.32,37.39 88.9,38.81 87.78,38.81 82.6,43.99 58.62,43.99 56.9,45.72 OK4.2
N$66
  Bottom 0.152: OK4.4 56.9,40.64 58.62,38.91 86.46,38.91 87.58,37.8 X1.3
N$68  (via drill 0.41)
  Top 0.203: v35.15,33.33 34.65,32.82 34.65,23.57 38.1,20.12 v38.1,8.64
  Bottom 0.203: v35.15,33.33 35.15,32 IC2.22 | v38.1,8.64 38.3,8.84 47.24,8.84 OK1.6
N$69  (via drill 0.41)
  Top 0.203: v35.36,30.58 35.56,30.38 v35.56,27.03
  Bottom 0.203: v35.36,30.58 34.65,30.58 34.65,31.9 IC2.23 | v35.56,27.03 37.19,25.4 OK2.8
N$70  (via drill 0.41)
  Top 0.203: v33.93,30.58 34.24,30.28 34.24,22.96 v36.88,20.32
  Bottom 0.203: v33.93,30.58 33.93,31.9 IC2.24 | OK2.6 v36.88,20.32
N$71  (via drill 0.41)
  Top 0.203: v37.8,34.24 39.52,35.97 v39.52,36.37
  Bottom 0.203: v37.8,34.24 33.33,34.24 33.33,32 IC2.25 | v39.52,36.37 39.93,36.78 47.24,36.78 OK3.8
N$72
  Bottom 0.203: IC2.26 32.72,31.9 32.72,29.87 45.41,29.87 47.24,31.7 OK3.6
N$73  (via drill 0.41)
  Top 0.203: v41.05,34.95 43.79,37.69 v43.79,44.81
  Bottom 0.203: v41.05,34.95 32,34.95 32,32 IC2.27 | v43.79,44.81 47.24,48.26 OK4.8

### Text on the board
_tsilk: SCL SDA | SKAARHOJ 2013 | PCB-2x8GPIO-U v13-05-13
_bsilk: I2C PullUps